# EAGLE design BoardRev3 (EAGLE 7.7.0)
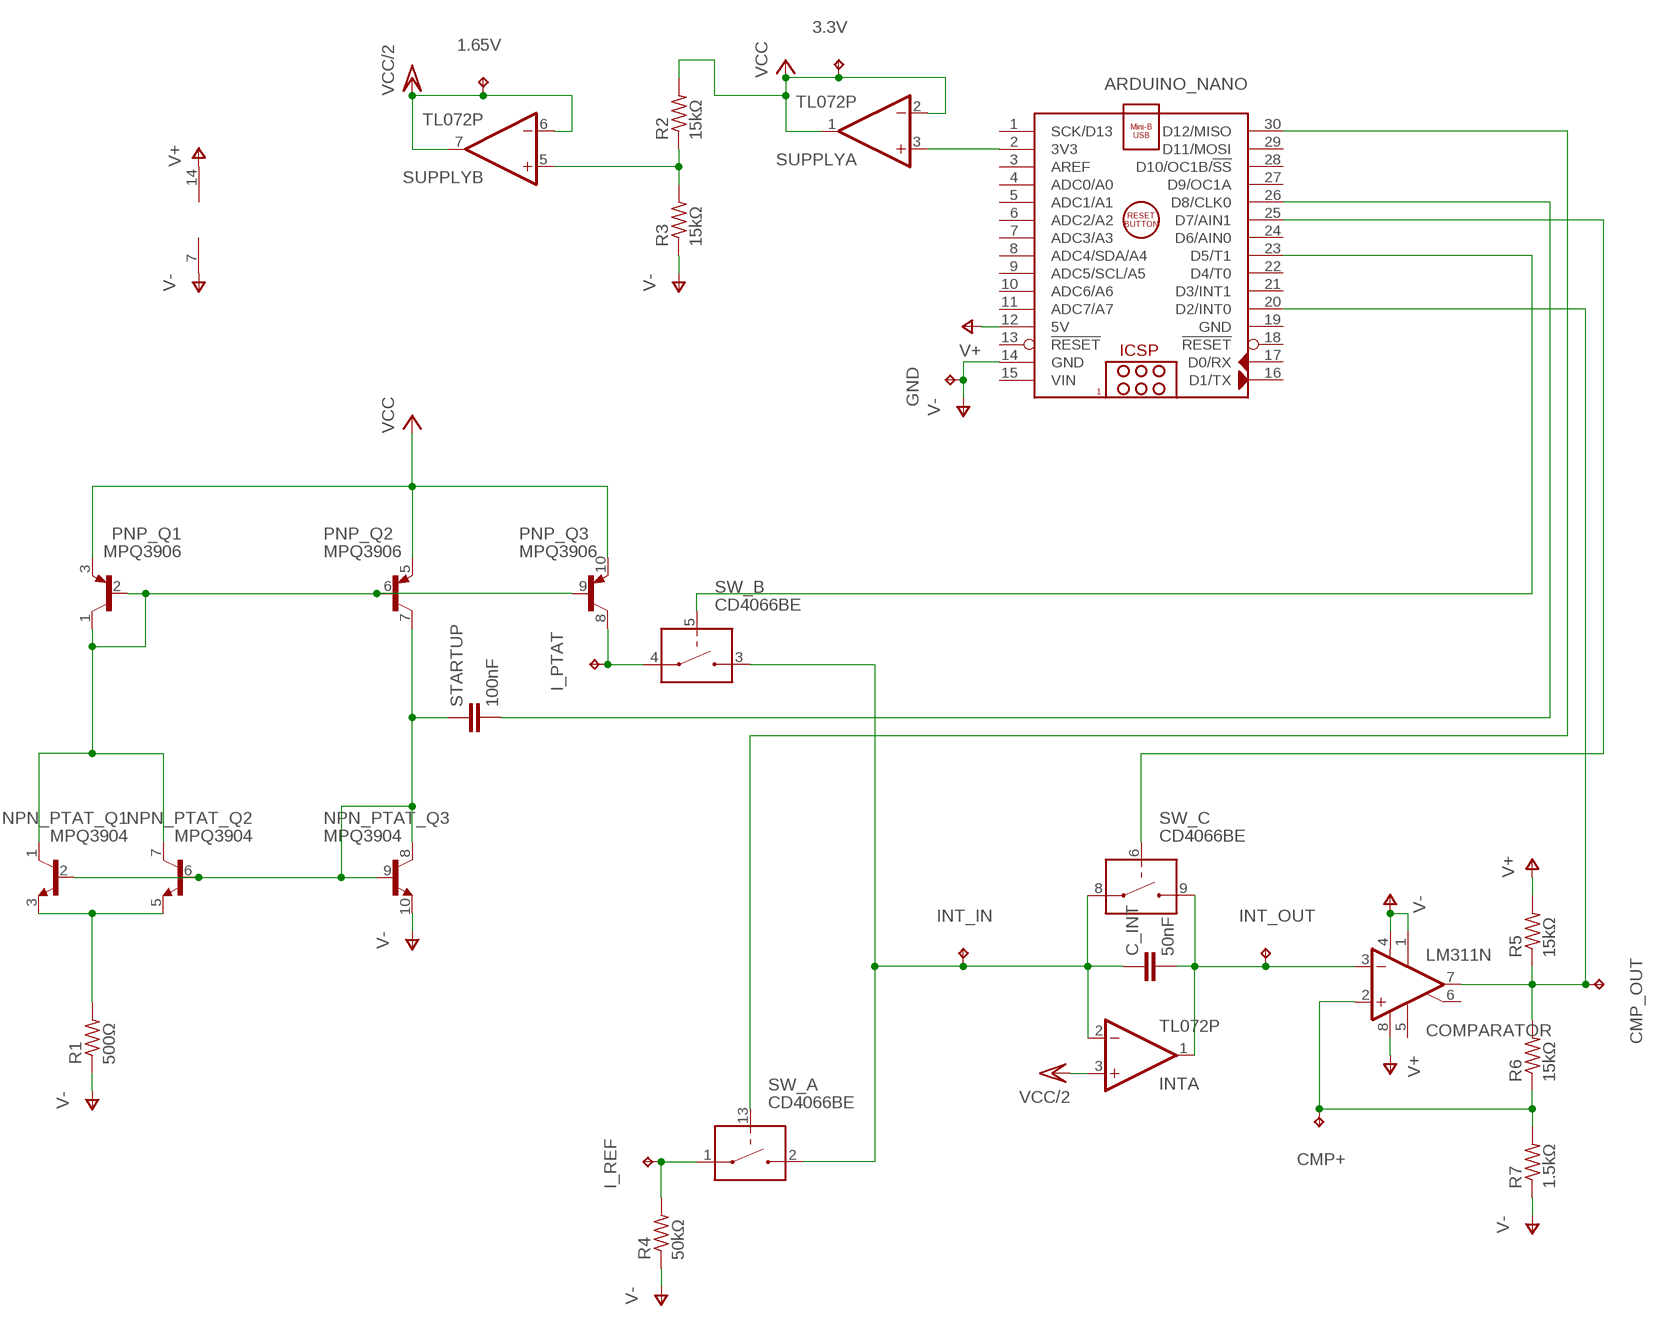
[diagram p0: schematic, sheet 1]

## Parts
1.65V  TESTPOINT  [KEYSTONE_5000_MINIATURE]
3.3V  TESTPOINT  [KEYSTONE_5000_MINIATURE]
ARDUINO_NANO  ARDUINO_NANO  [ARDUINO_NANO]
C_INT  50nF  C-EU025-025X050  [C025-025X050]
CMP+  TESTPOINT  [KEYSTONE_5000_MINIATURE]
CMP_OUT  TESTPOINT  [KEYSTONE_5000_MINIATURE]
COMPARATOR  LM311N  [DIL08]
GND  TESTPOINT  [KEYSTONE_5000_MINIATURE]
I_PTAT  TESTPOINT  [KEYSTONE_5000_MINIATURE]
I_REF  TESTPOINT  [KEYSTONE_5000_MINIATURE]
INT  TL072P  [DIL08]
INT_IN  TESTPOINT  [KEYSTONE_5000_MINIATURE]
INT_OUT  TESTPOINT  [KEYSTONE_5000_MINIATURE]
NPN_PTAT  MPQ3904  [DIL14]
PNP  MPQ3906  [DIL14]
R1  500Ω  R-US_0207/10  [0207/10]
R2  15kΩ  R-US_0207/10  [0207/10]
R3  15kΩ  R-US_0207/10  [0207/10]
R4  50kΩ  R-US_0207/10  [0207/10]
R5  15kΩ  R-US_0207/10  [0207/10]
R6  15kΩ  R-US_0207/10  [0207/10]
R7  1.5kΩ  R-US_0207/10  [0207/10]
STARTUP  100nF  C-EU050-030X075  [C050-030X075]
SUPPLY  TL072P  [DIL08]
SW  CD4066BE  [DIL14]

## Nets
+3V3: 3.3V.P$1 PNP.3(_Q1:E) PNP.5(_Q2:E) PNP.10(_Q3:E) R2.2 SUPPLY.1(A:OUT) SUPPLY.2(A:-IN) ; supply symbol labelled VCC
N$1: ARDUINO_NANO.26(D8/CLK0) STARTUP.2
N$2: NPN_PTAT.1(_Q1:C) NPN_PTAT.7(_Q2:C) PNP.1(_Q1:C) PNP.2(_Q1:B) PNP.6(_Q2:B) PNP.9(_Q3:B)
N$3: NPN_PTAT.3(_Q1:E) NPN_PTAT.5(_Q2:E) R1.2
N$4: ARDUINO_NANO.2(3V3) SUPPLY.3(A:+IN)
N$5: NPN_PTAT.2(_Q1:B) NPN_PTAT.6(_Q2:B) NPN_PTAT.8(_Q3:C) NPN_PTAT.9(_Q3:B) PNP.7(_Q2:C) STARTUP.1
N$6: CMP+.P$1 COMPARATOR.2(+IN) R6.1 R7.2
N$7: R2.1 R3.2 SUPPLY.5(B:+IN)
N$8: ARDUINO_NANO.20(D2/INT0) CMP_OUT.P$1 COMPARATOR.7(OUT) R5.1 R6.2
N$9: C_INT.1 INT.2(A:-IN) INT_IN.P$1 SW.2(_A:IN/OUT2) SW.3(_B:IN/OUT2) SW.8(_C:IN/OUT1)
N$10: C_INT.2 COMPARATOR.3(-IN) INT.1(A:OUT) INT_OUT.P$1 SW.9(_C:IN/OUT2)
N$11: I_PTAT.P$1 PNP.8(_Q3:C) SW.4(_B:IN/OUT1)
N$12: ARDUINO_NANO.30(D12/MISO) SW.13(_A:CONTROL)
N$13: I_REF.P$1 R4.2 SW.1(_A:IN/OUT1)
N$14: ARDUINO_NANO.23(D5/T1) SW.5(_B:CONTROL)
N$15: ARDUINO_NANO.25(D7/AIN1) SW.6(_C:CONTROL)
V+: ARDUINO_NANO.12(5V) COMPARATOR.8(V+) R5.2 SW.14(V+)
V-: ARDUINO_NANO.14(GND) COMPARATOR.1(GND) COMPARATOR.4(V-) GND.P$1 NPN_PTAT.10(_Q3:E) R1.1 R3.1 R4.1 R7.1 SW.7(V-)
VCC/2: 1.65V.P$1 INT.3(A:+IN) SUPPLY.6(B:-IN) SUPPLY.7(B:OUT)
Unconnected: ARDUINO_NANO.1(SCK/D13) ARDUINO_NANO.3(AREF) ARDUINO_NANO.4(ADC0/A0) ARDUINO_NANO.5(ADC1/A1) ARDUINO_NANO.6(ADC2/A2) ARDUINO_NANO.7(ADC3/A3) ARDUINO_NANO.8(ADC4/SDA/A4) ARDUINO_NANO.9(ADC5/SCL/A5) ARDUINO_NANO.10(ADC6/A6) ARDUINO_NANO.11(ADC7/A7) ARDUINO_NANO.13(!RESET) ARDUINO_NANO.16(D1/TX) ARDUINO_NANO.17(D0/RX) ARDUINO_NANO.18(!RESET) ARDUINO_NANO.21(D3/INT1) ARDUINO_NANO.22(D4/T0) ARDUINO_NANO.24(D6/AIN0) ARDUINO_NANO.27(D9/OC1A) ARDUINO_NANO.28(D10/OC1B/!SS) ARDUINO_NANO.29(D11/MOSI) COMPARATOR.5(ON) COMPARATOR.6(ON/STR) INT.5(B:+IN) INT.6(B:-IN) INT.7(B:OUT) NPN_PTAT.12(_Q4:E) NPN_PTAT.13(_Q4:B) NPN_PTAT.14(_Q4:C) PNP.12(_Q4:E) PNP.13(_Q4:B) PNP.14(_Q4:C) SW.10(_D:IN/OUT2) SW.11(_D:IN/OUT1) SW.12(_D:CONTROL)

## Power pins joined to a net without a drawn wire
GND: ARDUINO_NANO.19(GND)
V+: INT.8(P:V+) SUPPLY.8(P:V+)
V-: INT.4(P:V-) SUPPLY.4(P:V-)
VIN: ARDUINO_NANO.15(VIN)

## Library data of the parts
1.65V 3.3V CMP+ CMP_OUT GND I_PTAT I_REF INT_IN INT_OUT = 6301-temp-sensor-rev1:TESTPOINT; VALUE: KEYSTONE_5000
ARDUINO_NANO = 6301-temp-sensor-rev1:ARDUINO_NANO: Arduino Nano V3.0 Module Overview: The Arduino Nano is a small, complete, and breadboard-friendly board based on the ATmega328 (Arduino Nano 3.x) or ATmega168 (Arduino Nano 2.x). It has more or less the same functionality of the Arduino Duemilanove, but in a different package. It lacks only a DC power jack, and works with a Mini-B USB cable instead of a standard one. The Nano was designed and is being produced by Gravitech <http://www.gravitech.us/arna30wiatp.html>. General specifications: Item Value Microcontroller Atmel ATmega168 or ATmega328 Operating Voltage (logic level) 5 V Input Voltage (recommended) 7-12 V Input Voltage (limits) 6-20 V Digital I/O Pins 14 (of which 6 provide PWM output) Analog Input Pins 8 DC Current per I/O Pin 40 mA Flash Memory 16 KB (ATmega168) or 32 KB (ATmega328) of which 2 KB used by bootloader SRAM 1 KB (ATmega168) or 2 KB (ATmega328) EEPROM 512 bytes (ATmega168) or 1 KB (ATmega328) Clock Speed 16 MHz Dimensions (Inches) 0.73" x 1.70" Dimensions (mm) 18mm x 45mm Overall height About 9 mm (not including pins) Weigth 5 g Power: The Arduino Nano can be powered via the Mini-B USB connection, 6-20V unregulated external power supply (pin 30), or 5V regulated external power supply (pin 27). The power source is automatically selected to the highest voltage source. Memory: The ATmega168 has 16 KB of flash memory for storing code (of which 2 KB is used for the bootloader); the ATmega328 has 32 KB, (also with 2 KB used for the bootloader). The ATmega168 has 1 KB of SRAM and 512 bytes of EEPROM (which can be read and written with the EEPROM library); the ATmega328 has 2 KB of SRAM and 1 KB of EEPROM. Input and Output: Each of the 14 digital pins on the Nano can be used as an input or output, using pinMode(), digitalWrite(), and digitalRead() functions. They operate at 5 volts. Each pin can provide or receive a maximum of 40 mA and has an internal pull-up resistor (disconnected by default) of 20-50 kOhms. In addition, some pins have specialized functions. Visit Arduino - ArduinoBoardNano <https://www.arduino.cc/en/Main/ArduinoBoardNano>
C_INT STARTUP = resistor:C-EU: CAPACITOR, European symbol
COMPARATOR = 6301-temp-sensor-rev1:LM311: COMPARATOR
INT SUPPLY = 6301-temp-sensor-rev1:TL072: OP AMP
NPN_PTAT = 6301-temp-sensor-rev1:MPQ3904
PNP = 6301-temp-sensor-rev1:MPQ3906
R1-R7 = resistor:R-US_: RESISTOR, American symbol
SW = 6301-temp-sensor-rev1:CD4066BE

## Board
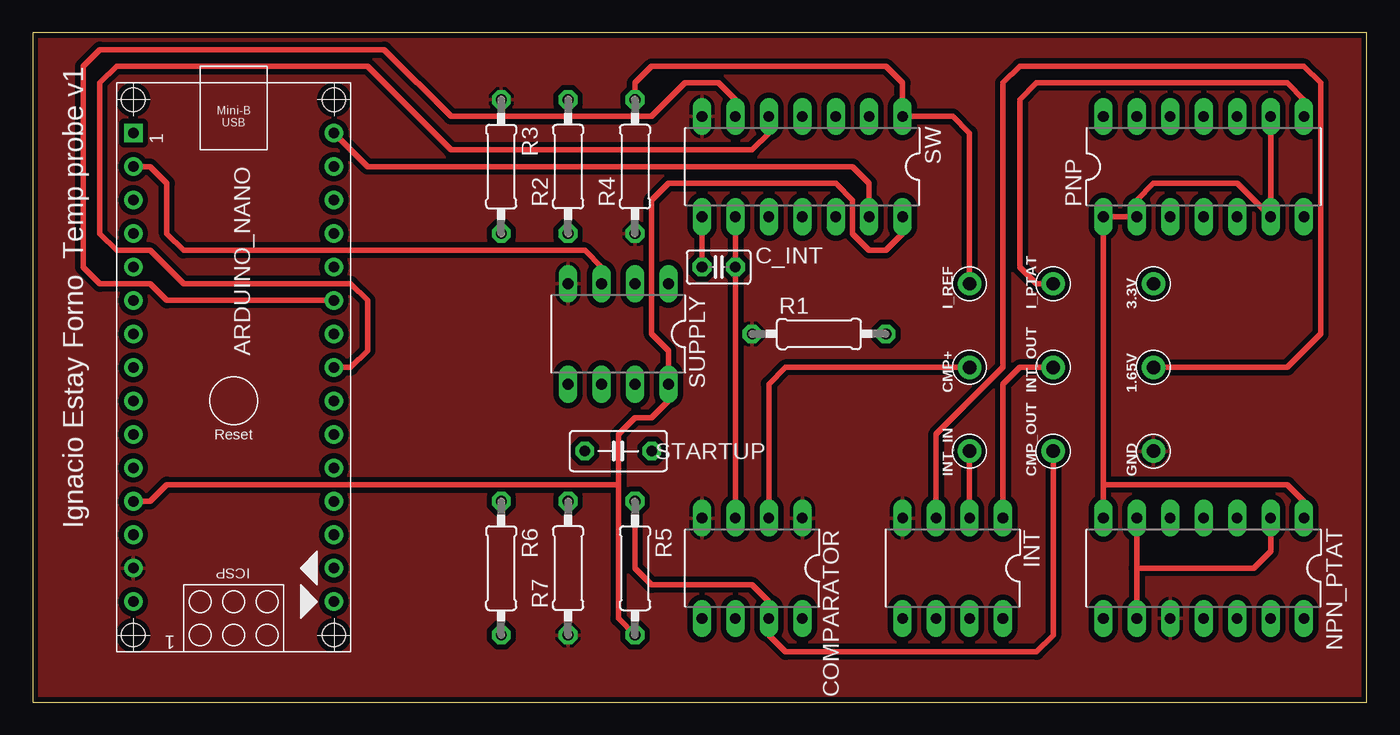
[diagram p1: board, top side]
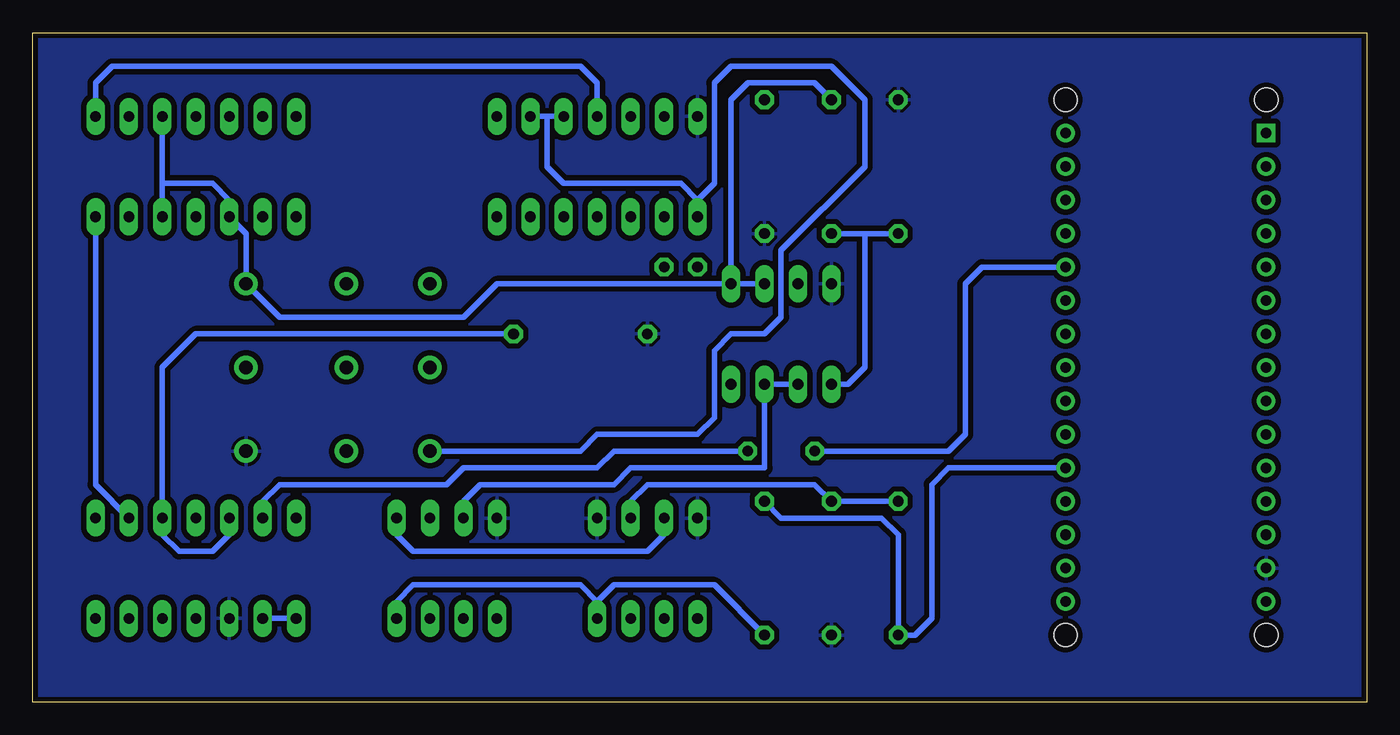
[diagram p2: board, bottom side, seen from below]

Size 101.27 x 50.79 mm. Coordinates in mm from the lower left corner, seen from the top.
Outline: 0,0 101.27,0 101.27,50.79 0,50.79 0,0
Copper layers (1*16): Top 0.035mm / dielectric 1.5mm / Bottom 0.035mm
Design rules "SparkFun": minimum track width 8mil, minimum drill 20mil, track to track 8mil, track to pad 8mil, pad to pad 8mil, via to via 8mil, smd to smd 8mil, copper to edge 8mil, drill to drill 8mil, minimum pad ring 12mil, minimum via ring 10mil, stop-mask expansion 4mil, vias tented up to drill 20mil, thermal gap 10mil

### Footprints (pad centres in the part's own frame; a part is rotated, then mirrored left to right if it is on the bottom)
KEYSTONE_5000_MINIATURE = drill 1.016 pad 1.778: P$1 0,0
ARDUINO_NANO = drill 0.8 square: 1 -20.32,-7.62 | drill 0.8: 2 -17.78,-7.62; 3 -15.24,-7.62; 4 -12.7,-7.62; 5 -10.16,-7.62; 6 -7.62,-7.62; 7 -5.08,-7.62; 8 -2.54,-7.62; 9 0,-7.62; 10 2.54,-7.62; 11 5.08,-7.62; 12 7.62,-7.62; 13 10.16,-7.62; 14 12.7,-7.62; 15 15.24,-7.62; 16 15.24,7.62; 17 12.7,7.62; 18 10.16,7.62; 19 7.62,7.62; 20 5.08,7.62; 21 2.54,7.62; 22 0,7.62; 23 -2.54,7.62; 24 -5.08,7.62; 25 -7.62,7.62; 26 -10.16,7.62; 27 -12.7,7.62; 28 -15.24,7.62; 29 -17.78,7.62; 30 -20.32,7.62 | hole 1.778: -22.86,-7.62; -22.86,7.62; 17.78,7.62; 17.78,-7.62
C025-025X050 = drill 0.813 octagon: 1 -1.27,0; 2 1.27,0
DIL08 = drill 0.813 long: 1 -3.81,-3.81; 2 -1.27,-3.81; 3 1.27,-3.81; 4 3.81,-3.81; 5 3.81,3.81; 6 1.27,3.81; 7 -1.27,3.81; 8 -3.81,3.81
DIL14 = drill 0.813 long: 1 -7.62,-3.81; 2 -5.08,-3.81; 3 -2.54,-3.81; 4 0,-3.81; 5 2.54,-3.81; 6 5.08,-3.81; 7 7.62,-3.81; 8 7.62,3.81; 9 5.08,3.81; 10 2.54,3.81; 11 0,3.81; 12 -2.54,3.81; 13 -5.08,3.81; 14 -7.62,3.81
0207/10 = drill 0.813 octagon: 1 -5.08,0; 2 5.08,0
C050-030X075 = drill 0.813 octagon: 1 -2.54,0; 2 2.54,0

### Placement (x,y rotation side)
1.65V  85.09,25.4 90 top
3.3V  85.09,31.75 90 top
ARDUINO_NANO  15.24,22.86 270 top
C_INT  52.07,33.02 0 top
CMP+  71.12,25.4 90 top
CMP_OUT  77.47,19.05 90 top
COMPARATOR  54.61,10.16 180 top
GND  85.09,19.05 90 top
I_PTAT  77.47,31.75 90 top
I_REF  71.12,31.75 90 top
INT  69.85,10.16 180 top
INT_IN  71.12,19.05 90 top
INT_OUT  77.47,25.4 90 top
NPN_PTAT  88.9,10.16 180 top
PNP  88.9,40.64 0 top
R1  59.69,27.94 0 top
R2  40.64,40.64 90 top
R3  35.56,40.64 270 top
R4  45.72,40.64 90 top
R5  45.72,10.16 270 top
R6  35.56,10.16 270 top
R7  40.64,10.16 90 top
STARTUP  44.45,19.05 180 top
SUPPLY  44.45,27.94 180 top
SW  58.42,40.64 180 top

### Tracks (layer width: path | path; a pad name or v marks a point on that pad's centre or on a via)
+3V3
  Bottom 0.406: SUPPLY.1 SUPPLY.2 | PNP.5 91.44,39.37 | 91.44,39.37 PNP.10 | 91.44,39.37 87.63,39.37 86.36,38.1 PNP.3 85.09,35.56 3.3V.P$1 82.55,29.21 68.58,29.21 66.04,31.75 SUPPLY.1 | R2.2 41.91,46.99 46.99,46.99 48.26,45.72 SUPPLY.1
N$1
  Bottom 0.406: STARTUP.2 31.75,19.05 30.48,20.32 30.48,31.75 29.21,33.02 ARDUINO_NANO.26
N$2
  Top 0.406: NPN_PTAT.7 81.28,16.51 | 81.28,16.51 PNP.1 PNP.2 83.82,38.1 85.09,39.37 91.44,39.37 PNP.6 PNP.9 | NPN_PTAT.1 96.52,15.24 95.25,16.51 81.28,16.51
N$3
  Bottom 0.406: NPN_PTAT.5 86.36,12.7 87.63,11.43 90.17,11.43 91.44,12.7 NPN_PTAT.3 91.44,25.4 88.9,27.94 R1.2
N$4
  Top 0.406: SUPPLY.3 43.18,33.02 41.91,34.29 11.43,34.29 10.16,35.56 10.16,39.37 8.89,40.64 ARDUINO_NANO.2
N$5
  Top 0.406: NPN_PTAT.6 83.82,10.16 | 83.82,10.16 NPN_PTAT.9 | NPN_PTAT.2 93.98,11.43 92.71,10.16 83.82,10.16
  Bottom 0.406: NPN_PTAT.9 NPN_PTAT.8 | PNP.7 96.52,16.51 NPN_PTAT.2 | NPN_PTAT.6 83.82,15.24 82.55,16.51 69.85,16.51 68.58,17.78 58.42,17.78 57.15,19.05 STARTUP.1
N$6
  Top 0.406: CMP+.P$1 57.15,25.4 55.88,24.13 COMPARATOR.2
  Bottom 0.406: R6.1 R7.2 41.91,16.51 54.61,16.51 55.88,15.24 COMPARATOR.2
N$7
  Bottom 0.406: R3.2 38.1,35.56 | 38.1,35.56 R2.1 | SUPPLY.5 39.37,24.13 38.1,25.4 38.1,35.56
N$8
  Top 0.406: R5.1 45.72,10.16 46.99,8.89 54.61,8.89 55.88,7.62 COMPARATOR.7 55.88,5.08 57.15,3.81 76.2,3.81 77.47,5.08 CMP_OUT.P$1
  Bottom 0.406: ARDUINO_NANO.20 31.75,17.78 33.02,16.51 33.02,6.35 34.29,5.08 R6.2 35.56,12.7 36.83,13.97 44.45,13.97 R5.1
N$9
  Top 0.406: SW.8 C_INT.1 | INT.2 INT_IN.P$1
  Bottom 0.406: SW.3 62.23,44.45 | 62.23,44.45 SW.2 | SW.8 50.8,38.1 | 50.8,38.1 52.07,39.37 60.96,39.37 62.23,40.64 62.23,44.45 | INT_IN.P$1 59.69,19.05 58.42,20.32 50.8,20.32 49.53,21.59 49.53,26.67 48.26,27.94 45.72,27.94 44.45,29.21 44.45,34.29 38.1,40.64 38.1,45.72 40.64,48.26 48.26,48.26 49.53,46.99 49.53,39.37 50.8,38.1
N$10
  Top 0.406: SW.9 C_INT.2 COMPARATOR.3 | INT_OUT.P$1 74.93,25.4 73.66,24.13 INT.1
  Bottom 0.406: COMPARATOR.3 53.34,12.7 54.61,11.43 72.39,11.43 73.66,12.7 INT.1
N$11
  Top 0.406: PNP.8 96.52,45.72 95.25,46.99 76.2,46.99 74.93,45.72 74.93,33.02 76.2,31.75 I_PTAT.P$1
  Bottom 0.406: PNP.8 96.52,46.99 95.25,48.26 59.69,48.26 58.42,46.99 SW.4
N$12
  Top 0.406: ARDUINO_NANO.30 25.4,40.64 62.23,40.64 63.5,39.37 SW.13
N$13
  Top 0.406: I_REF.P$1 71.12,43.18 69.85,44.45 SW.1 66.04,46.99 64.77,48.26 46.99,48.26 45.72,46.99 R4.2
N$14
  Top 0.406: ARDUINO_NANO.23 24.13,25.4 25.4,26.67 25.4,30.48 24.13,31.75 11.43,31.75 8.89,34.29 6.35,34.29 5.08,35.56 5.08,46.99 6.35,48.26 25.4,48.26 31.75,41.91 54.61,41.91 55.88,43.18 SW.5
N$15
  Top 0.406: ARDUINO_NANO.25 10.16,30.48 8.89,31.75 5.08,31.75 3.81,33.02 3.81,48.26 5.08,49.53 26.67,49.53 31.75,44.45 46.99,44.45 49.53,46.99 52.07,46.99 53.34,45.72 SW.6
V+
  Top 0.406: 44.45,16.51 44.45,20.32 45.72,21.59 46.99,21.59 48.26,22.86 SUPPLY.8 48.26,26.67 46.99,27.94 46.99,38.1 48.26,39.37 60.96,39.37 62.23,38.1 62.23,35.56 63.5,34.29 64.77,34.29 66.04,35.56 SW.14 | 44.45,16.51 44.45,6.35 R5.2 | ARDUINO_NANO.12 8.89,15.24 10.16,16.51 44.45,16.51
  Bottom 0.406: R5.2 49.53,8.89 57.15,8.89 58.42,7.62 | COMPARATOR.8 58.42,7.62 | 58.42,7.62 59.69,8.89 72.39,8.89 73.66,7.62 INT.8
V-
  pour Bottom (isolate 0.406): 0,50.8 0,0 101.6,0 101.6,50.8
  pour Top (isolate 0.406): 0,50.8 101.6,50.8 101.6,0 0,0
VCC/2
  Top 0.406: 1.65V.P$1 95.25,25.4 97.79,27.94 97.79,46.99 96.52,48.26 74.93,48.26 73.66,46.99 73.66,25.4 68.58,20.32 INT.3
  Bottom 0.406: SUPPLY.6 SUPPLY.7 45.72,17.78 55.88,17.78 57.15,16.51 67.31,16.51 68.58,15.24 INT.3

### Text on the board
tNames: Ignacio Estay Forno Temp probe v1